# Altium schematic sheet 电源电路.SchDoc
size A4
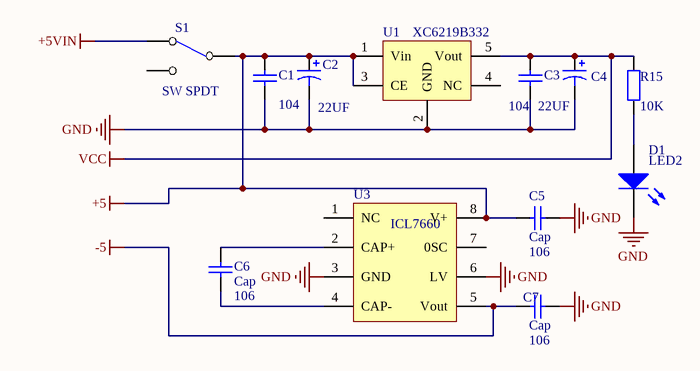
[diagram p0: 电源电路.SchDoc]

## Parts
C1  value 104  [C0805]  (hidden comment: Cap)
C2  value 22UF  [C1210_N]  (hidden comment: Cap Pol1)
C3  value 104  [C0805]  (hidden comment: Cap)
C4  value 22UF  [C1210_N]  (hidden comment: Cap Pol1)
C5  Cap  value 106  [C0805]
C6  Cap  value 106  [C0805]
C7  Cap  value 106  [C0805]
D1  LED2  [D0805+]
R15  value 10K  [6-0805_N]  (hidden comment: Res2)
S1  SW SPDT  [SW-SPDT-7P]
U1  XC6219B332  [SOT23-5L]
U3  ICL7660  [SO8_N]

## Nets
+5: C1.2 C2.1 C5.2 S1.2(COMMON) U1.1(Vin) U1.3(CE) U3.8(V+)
+5VIN: S1.1(NC)
-5: C7.2 U3.5(Vout)
GND: C1.1 C2.2 C3.1 C4.2 C5.1 C7.1 D1.K U1.2(GND) U3.3(GND) U3.6(LV)
VCC: C3.2 C4.1 R15.2 U1.5(Vout)
NetC6_1: C6.1 U3.2(CAP+)
NetC6_2: C6.2 U3.4(CAP-)
NetD1_A: D1.A R15.1

Not connected (* = marked no-connect by the designer): S1 3(NO); U1 4(NC); U3 1(NC) 7(0SC)

## Library data of the parts
C1 C3 C5-C7 = Cap: Capacitor; Published: 8-Jun-2000; LatestRevisionDate: 17-Jul-2002; LatestRevisionNote: Re-released for DXP Platform.; PackageReference: RAD-0.3; Publisher: Altium Limited; PackageDescription: Radial Cap, Thru-Hole; 2 Leads; 0.3 in Pin Spacing
C2 C4 = Cap Pol1: Polarized Capacitor (Radial); Published: 8-Jun-2000; LatestRevisionDate: 17-Jul-2002; LatestRevisionNote: Re-released for DXP Platform.; PackageReference: RB7.6-15; Publisher: Altium Limited; PackageDescription: Polarized Capacitor (Radial); 2 Leads
D1 = LED2: Typical RED, GREEN, YELLOW, AMBER GaAs LED; Published: 8-Jun-2000; LatestRevisionDate: 17-Jul-2002; LatestRevisionNote: Re-released for DXP Platform.; PackageVersion: Feb-2002; PackageReference: 3.2X1.6X1.1; Publisher: Altium Limited; PackageDescription: SM LED; 2 Flat Leads
R15 = Res2: Resistor; Published: 8-Jun-2000; LatestRevisionDate: 17-Jul-2002; LatestRevisionNote: Re-released for DXP Platform.; PackageReference: AXIAL-0.4; Publisher: Altium Limited; PackageDescription: Axial Device, Thru-Hole; 2 Leads; 0.4 in Pin Spacing
U1 = XC6219